# Altium schematic sheet Prometheus_ADTC_V1.1.SchDoc
size A
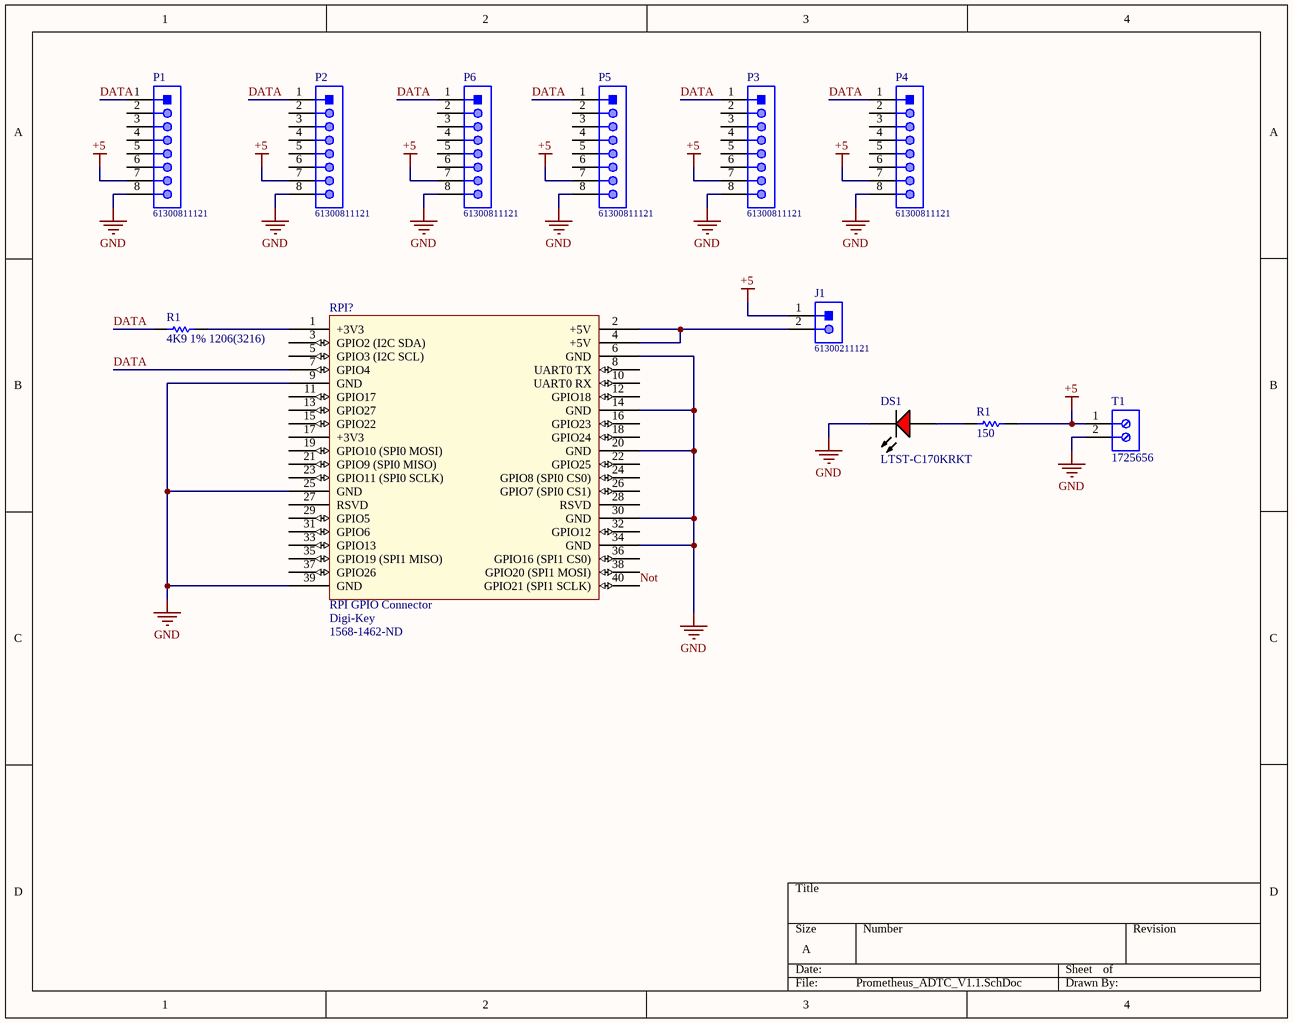
[diagram p0: Prometheus_ADTC_V1.1.SchDoc]

## Parts
(Parts that share a designator on the sheet are numbered #1, #2 ... from top to bottom, then left to right.)
DS1  LTST-C170KRKT  [LTST-C170KRKT_V]
J1  61300211121  [61300211121]
P1  61300811121  [61300811121]
P2  61300811121  [61300811121]
P3  61300811121  [61300811121]
P4  61300811121  [61300811121]
P5  61300811121  [61300811121]
P6  61300811121  [61300811121]
R1#1  4K9 1% 1206(3216)  [RESC1206(3216)_L]
R1#2  150  [RESC1206(3216)_M]
RPI?  RPI GPIO Connector  Supplier 1: Digi-Key  Supplier Part Number 1: 1568-1462-ND  [rpi]
T1  1725656  [PHOE-1725656-2]

## Nets
+5: J1.1 P1.7 P2.7 P3.7 P4.7 P5.7 P6.7 R1#2.1 T1.1
GND: DS1.2(K) P1.8 P2.8 P3.8 P4.8 P5.8 P6.8 RPI?.6(GND) RPI?.9(GND) RPI?.14(GND) RPI?.20(GND) RPI?.25(GND) RPI?.30(GND) RPI?.34(GND) RPI?.39(GND) T1.2
DATA: P1.1 P2.1 P3.1 P4.1 P5.1 P6.1 R1#1.1 RPI?.7(GPIO4)
Not: RPI?.40(GPIO21_(SPI1_SCLK))
NetDS1_1: DS1.1(A) R1#2.2
NetJ1_2: J1.2 RPI?.2(+5V) RPI?.4(+5V)
NetR1#1_2: R1#1.2 RPI?.1(+3V3)

Not connected (* = marked no-connect by the designer): P1 2 3 4 5 6; P2 2 3 4 5 6; P3 2 3 4 5 6; P4 2 3 4 5 6; P5 2 3 4 5 6; P6 2 3 4 5 6; RPI? 3(GPIO2_(I2C_SDA)) 5(GPIO3_(I2C_SCL)) 8(UART0_TX) 10(UART0_RX) 11(GPIO17) 12(GPIO18) 13(GPIO27) 15(GPIO22) 16(GPIO23) 17(+3V3) 18(GPIO24) 19(GPIO10_(SPI0_MOSI)) 21(GPIO9_(SPI0_MISO)) 22(GPIO25) 23(GPIO11_(SPI0_SCLK)) 24(GPIO8_(SPI0_CS0)) 26(GPIO7_(SPI0_CS1)) 27(RSVD) 28(RSVD) 29(GPIO5) 31(GPIO6) 32(GPIO12) 33(GPIO13) 35(GPIO19_(SPI1_MISO)) 36(GPIO16_(SPI1_CS0)) 37(GPIO26) 38(GPIO20_(SPI1_MOSI))

## Library data of the parts
DS1 = CMP-2000-07593-1: LED Red, 75 mW, 54 mcd, -55 to 85 degC, 2-Pin SMD, RoHS, Tape and Reel; Manufacturer: Lite-On; Lens Transparency: Clear; Number of Elements: 1; Power Rating: 75mW; Luminous Intensity: 54mcd; Viewing Angle: 130degrees; Forward Current: 30mA; Wavelength: 639nm; Lens Style: Rectangular; Case\/Package: 0805; Test Current: 20mA; Dominant Wavelength: 631nm; Forward Voltage: 2V; Lens Colour: Colorless; Min Operating Temperature: -55degC; RoHSCompliant: True; Length: 3.2mm; Width: 1.25mm; Mount: SurfaceMount; Packaging: TapeandReel; Number of LEDs: 1; Radiation Hardening: No; Datasheet URL: http://optoelectronics.liteon.com/upload/download/DS-22-99-0150/LTST-C170KRKT.pdf; Datasheet Version: Rev. D, 11/2014; Case Code (Metric): 2012; Height: 1.1mm; Number of Pins: 2; Package Description: 2-Pin Surface Mount Device, Body 2 x 1.25 mm; Manufacturer URL: http://www.us.liteon.com/; Lead Free: LeadFree; Illumination Colour: Red; Colour: Red; Case Code (Imperial): 0805; Max Operating Temperature: 85degC; Power Dissipation: 75mW; Mounting Technology: SurfaceMount; Package Reference: C170KRKT; Package Quantity: 1; Depth: 1.6mm
J1 = CMP-1502-01060-1: THT Vertical Pin Header WR-PHD, Pitch 2.54 mm, Single Row, 2 pins; Manufacturer: Wurth Elektronik; Rated Current: 3A; Gender: Male; Withstanding Voltage: 500VAC; Working Voltage: 250VAC; Pitch: 2.54mm; Contact Resistance: 20mOhm; Pin Number: 2; Mounting Technology: THT; Orientation: Vertical; Operating Temperature: -40to105degC; Packaging: Bag; Publisher: WurthElektronik; Datasheet URL: https://katalog.we-online.de/em/datasheet/6130xx11121.pdf; Manufacturer URL: http://www.we-online.de; Row Number: Single; Package Reference: 61300211121; Part Number: 61300211121
P1-P6 = CMP-1502-01076-1: THT Vertical Pin Header WR-PHD, Pitch 2.54 mm, Single Row, 8 pins; Manufacturer: Wurth Elektronik; Rated Current: 3A; Pin Number: 8; Working Voltage: 250VAC; Gender: Male; Contact Resistance: 20mOhm; Pitch: 2.54mm; Withstanding Voltage: 500VAC; Publisher: WurthElektronik; Operating Temperature: -40to105degC; Orientation: Vertical; Row Number: Single; Part Number: 61300811121; Package Reference: 61300811121; Mounting Technology: THT; Packaging: Bag; Manufacturer URL: http://www.we-online.de; Datasheet URL: https://katalog.we-online.de/em/datasheet/6130xx11121.pdf
R1#1 = CMP-1014-00586-1: 4K7 0.25W 1% 1206 (3216 Metric)  SMD; Case-Metric: 3216; Case-EIA: 1206; Value: 4700.00 Ohm; Tolerance: 1 %; Technology: SMT; Power: 0.25 W
R1#2 = CMP-1014-00526-1: 1K43 0.25W 1% 1206 (3216 Metric)  SMD; Value: 1430.00 Ohm; Case-EIA: 1206; Case-Metric: 3216; Power: 0.25 W; Technology: SMT; Tolerance: 1 %
RPI? = rpi connector: GPIO Header for Raspberry Pi A+/B+/Pi 2/Pi 3 - 2x20; Manufacturer: SparkFun Electronics; Manufacturer Part Number: PRT-14017; Nils Minor: author; nilsminor@web.de: mail; RoHS: RoHS Compliant; Category: Development Boards, Kits, Programmers; Stock 1: 150; Pricing 1: 1=1.84 (EUR); Part Status: Active; Accessory Type: Connector; For Use With/Related Products: Raspberry Pi; ComponentLink1URL: https://cdn.sparkfun.com/datasheets/Dev/RaspberryPi/12313.pdf; ComponentLink1Description: https://cdn.sparkfun.com/datasheets/Dev/RaspberryPi/12313.pdf
T1 = CMP-2000-05299-1: Male Header, Pitch 2.54 mm, 1 x 2 Position, Height 9 mm, Tail Length 3.5 mm; Manufacturer: Phoenix Contact; Colour: Green; Number of contacts: 2; Content: 250pc(s); Pitch: 2.54mm; Type: MPT0,5/2-2,54; Industrial packaging: Yes; Manufacturer part No.: 1725656; Datasheet URL: http://datasheet.octopart.com/1725656-Phoenix-Contact-datasheet-5302866.pdf; Manufacturer URL: http://www.phoenixcontact.com/; Datasheet Version: Apr-08